# Altium schematic sheet A4_SH1(With_Logo).SchDoc
size A4; SheetNumber: 6; SheetTotal: 5
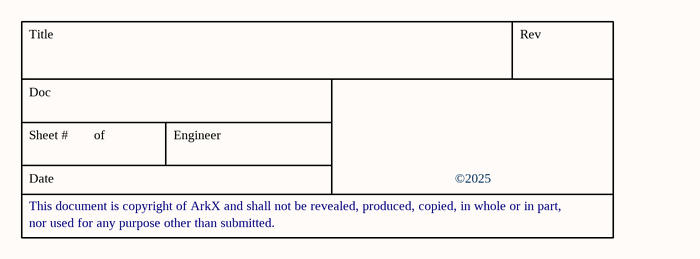
[diagram p0: A4_SH1(With_Logo).SchDoc]

## Notes on the sheet
- Title
- Rev
- Doc
- Sheet #
- of
- Engineer
- This document is copyright of ArkX and shall not be revealed, produced, copied, in whole or in part,
- Date
- ©2025
- nor used for any purpose other than submitted.